# Altium schematic sheet Sheet1.SchDoc
size A4; SheetNumber: 1; SheetTotal: 2
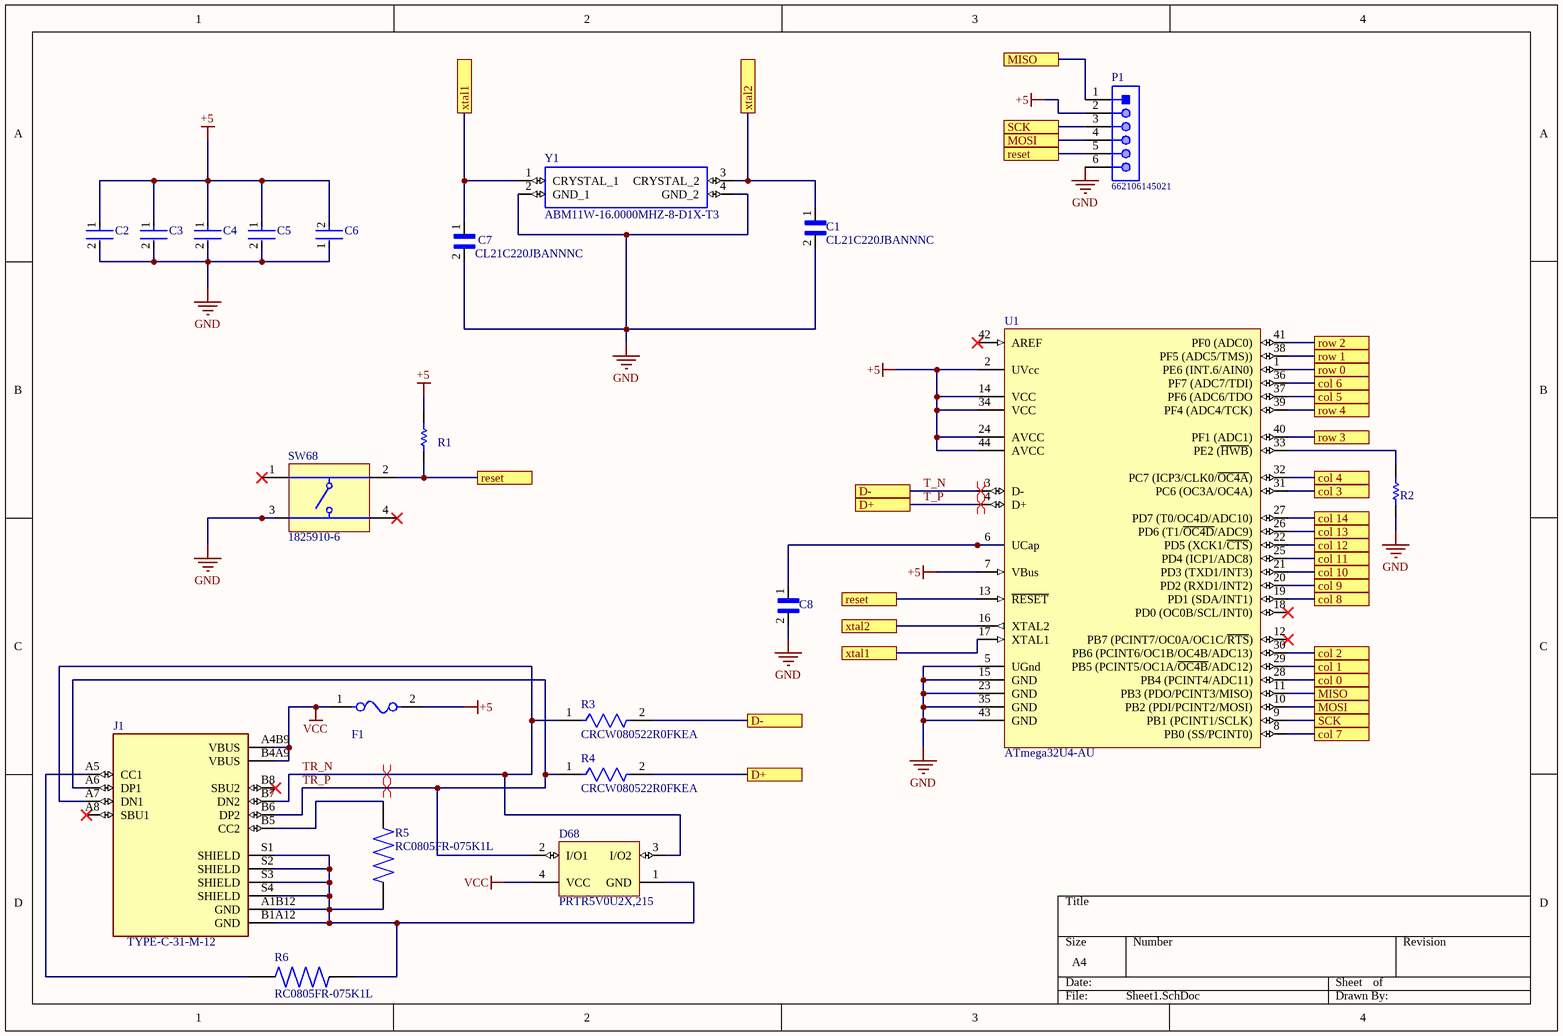
[diagram p0: Sheet1.SchDoc]

## Parts
C1  CL21C220JBANNNC  [CAPC2012X140N]
C2  (no value)  [FP-CL21-IPC_C]
C3  (no value)  [FP-CL21-IPC_C]
C4  (no value)  [FP-CL21-IPC_C]
C5  (no value)  [FP-CL21-IPC_C]
C6  (no value)  [FP-CL21B106KOQNNNE-MFG]
C7  CL21C220JBANNNC  [CAPC2012X140N]
C8  CL21B105KAFNNNE  [CAPC2012X140N]  (value not drawn)
D68  PRTR5V0U2X,215  [NXP-SOT143B-4_V]
F1  Fuse_Bel_0ZCJ0025AF2E_eec  [Bel_3216_0]  (value not drawn)
J1  TYPE-C-31-M-12  [HRO_TYPE-C-31-M-12]
P1  662106145021  [662106145021]
R1  RC0805FR-0710KL  [RESC2013X60X35NL10T20]  (value not drawn)
R2  RC0805FR-0710KL  [RESC2013X60X35NL10T20]  (value not drawn)
R3  CRCW080522R0FKEA  [FP-CRCW0805-e3-IPC_C]
R4  CRCW080522R0FKEA  [FP-CRCW0805-e3-IPC_C]
R5  RC0805FR-075K1L  [RESC2012X60N]
R6  RC0805FR-075K1L  [RESC2012X60N]
SW68  1825910-6  [TECO-1825910-6_V]
U1  ATmega32U4-AU  [44ML_M]
Y1  ABM11W-16.0000MHZ-8-D1X-T3  [ABM11W300000MHZ4B1UT3]

## Ports
col 0, col 1, col 2, col 3, col 4, col 5, col 6, col 7, col 8, col 9, col 10, col 11, col 12, col 13, col 14, D+, D-, MISO, MOSI, reset, row 0, row 1, row 2, row 3, row 4, SCK, xtal1, xtal2

## Nets
+5: C2.1 C3.1 C4.1 C5.1 C6.2 F1.2 P1.2 R1.2 U1.2(UVcc) U1.7(VBus) U1.14(VCC) U1.24(AVCC) U1.34(VCC) U1.44(AVCC)
GND: C1.2 C2.2 C3.2 C4.2 C5.2 C6.1 C7.2 C8.2 P1.6 R2.1 SW68.3 U1.5(UGnd) U1.15(GND) U1.23(GND) U1.35(GND) U1.43(GND) Y1.2(GND_1) Y1.4(GND_2)
VCC: D68.4(VCC) F1.1 J1.A4B9(VBUS) J1.B4A9(VBUS)
col 0: U1.28(PB4_(PCINT4/ADC11)) ; port col 0
col 1: U1.29(PB5_(PCINT5/OC1A/~{OC4B}/ADC12)) ; port col 1
col 2: U1.30(PB6_(PCINT6/OC1B/OC4B/ADC13)) ; port col 2
col 3: U1.31(PC6_(OC3A/OC4A)) ; port col 3
col 4: U1.32(PC7_(ICP3/CLK0/~{OC4A})) ; port col 4
col 5: U1.37(PF6_(ADC6/TDO) ; port col 5
col 6: U1.36(PF7_(ADC7/TDI)) ; port col 6
col 7: U1.8(PB0_(SS/PCINT0)) ; port col 7
col 8: U1.19(PD1_(SDA/INT1)) ; port col 8
col 9: U1.20(PD2_(RXD1/INT2)) ; port col 9
col 10: U1.21(PD3_(TXD1/INT3)) ; port col 10
col 11: U1.25(PD4_(ICP1/ADC8)) ; port col 11
col 12: U1.22(PD5_(XCK1/~{CTS})) ; port col 12
col 13: U1.26(PD6_(T1/~{OC4D}/ADC9)) ; port col 13
col 14: U1.27(PD7_(T0/OC4D/ADC10)) ; port col 14
MISO: P1.1 U1.11(PB3_(PDO/PCINT3/MISO)) ; port MISO
MOSI: P1.4 U1.10(PB2_(PDI/PCINT2/MOSI)) ; port MOSI
reset: P1.5 R1.1 SW68.2 U1.13(~{RESET}) ; port reset
row 0: U1.1(PE6_(INT.6/AIN0)) ; port row 0
row 1: U1.38(PF5_(ADC5/TMS))) ; port row 1
row 2: U1.41(PF0_(ADC0)) ; port row 2
row 3: U1.40(PF1_(ADC1)) ; port row 3
row 4: U1.39(PF4_(ADC4/TCK)) ; port row 4
SCK: P1.3 U1.9(PB1_(PCINT1/SCLK)) ; port SCK
T_N: R3.2 U1.3(D-) ; port D-
T_P: R4.2 U1.4(D+) ; port D+
TR_N: D68.3(I/O2) J1.A7(DN1) J1.B7(DN2) R3.1
TR_P: D68.2(I/O1) J1.A6(DP1) J1.B6(DP2) R4.1
xtal1: C7.1 U1.17(XTAL1) Y1.1(CRYSTAL_1) ; port xtal1
xtal2: C1.1 U1.16(XTAL2) Y1.3(CRYSTAL_2) ; port xtal2
NetC8_1: C8.1 U1.6(UCap)
NetD68_1: D68.1(GND) J1.A1B12(GND) J1.B1A12(GND) J1.S1(SHIELD) J1.S2(SHIELD) J1.S3(SHIELD) J1.S4(SHIELD) R5.1 R6.2
NetJ1_A5: J1.A5(CC1) R6.1
NetJ1_B5: J1.B5(CC2) R5.2
NetR2_2: R2.2 U1.33(PE2_(~{HWB}))

Not connected (* = marked no-connect by the designer): J1 A8(SBU1)* B8(SBU2)*; SW68 1* 4*; U1 12(PB7_(PCINT7/OC0A/OC1C/~{RTS}))* 18(PD0_(OC0B/SCL/INT0))* 42(AREF)*

## Layout directives
differential pair: T_N, T_P, TR_N, TR_P

## Library data of the parts
C1 C7 = CL21C220JBANNNC: 22pF Â±5% 50V Ceramic Capacitor C0G, NP0 0805 _2012 Metric_; MF: Samsung; Value: *; Price: None; Package: 0805 Samsung; SnapEDA_Link: https://www.snapeda.com/parts/CL21C220JBANNNC/Samsung%20Electro-Mechanics/view-part/514319/?ref=snap; Availability: Unavailable; MP: CL21C220JBANNNC
C2-C5 = CMP-2000-05017-2: CL21 Series 0805 100nF 50V ±10% Tolerance X7R Multilayer Ceramic Chip Capacitor; Depth: 1.25mm; Height: 0.85mm; Width: 0.049inch; Tolerance: 10%; Case Code (Metric): 2012; Case Code (Imperial): 0805; Material: Ceramic; Thickness: 0.037inch; Min Operating Temperature: -55°C; Contact Plating: Tin; Length: 2mm; Mount: Surface Mount; Voltage Rating (DC): 50V; Lead Free: Lead Free; Dielectric: X7R; Radiation Hardening: No; Capacitance: 100nF; Voltage Rating: 50V; Case/Package: 0805; Packaging: Tape and Reel; Max Operating Temperature: 125°C; Voltage: 50V
C6 = CMP-2000-06106-2: CAP CER 10UF 16V X7R 0805; Manufacturer Part Number: CL21B106KOQNNNE; Manufacturer: Samsung Electro-Mechanics America, Inc; Material: Ceramic; Tolerance: 10%; Temperature Coefficient: 15%; Digikey Description: CAP CER 10UF 16V X7R 0805; Lead Free: Yes; ComponentLink2URL: http://www.samsungsem.com/servlet/FileDownload?path=productsearch&sname=CL21B106KOQNNNE.pdf&oname=CL21B106KOQNNNE.pdf; ComponentLink2Description: Datasheet; Temperature Range Low: -55°C; RoHS: TRUE; Category: Cap; Temperature Characteristic: X7R; Automotive: No; Octopart: https://octopart.com/cl21b106koqnnne-samsung-19832289; Device Class L3: Ceramic Capacitors; Temperature Range High: +125°C; Height: 1.4mm; Device Class L2: Capacitors; Voltage Rating: 16V; Value: 10uF; Temperature: -55°C to +125°C; Device Class L1: Passive Components; Ipc Land Pattern Name: CAPC200125X125; Package: CL21B106KOQNNNE; Capacitance: 10uF
C8 = CL21B105KAFNNNE: 1ÂµF Â±10% 25V Ceramic Capacitor X7R 0805 (2012 Metric); MF: Samsung Electro-Mechanics; SnapEDA_Link: https://www.snapeda.com/parts/CL21B105KAFNNNE/Samsung%20Electro-Mechanics/view-part/544120/?ref=snap; Arrow_Electronics-Purchase-URL: https://snapeda.com/shop?store=Arrow+Electronics&id=544120; Arrow_Europe-Purchase-URL: https://snapeda.com/shop?store=Arrow+Europe&id=544120; MP: CL21B105KAFNNNE; Package: 0805 Samsung; DigiKey-Purchase-URL: https://snapeda.com/shop?store=DigiKey&id=544120; Digi-Key_Part_Number: 1276-1066-1-ND; Value: *; Check_prices: https://www.snapeda.com/parts/CL21B105KAFNNNE/Samsung%20Electro-Mechanics/view-part/544120/?ref=eda
D68 = CMP-2000-05285-1: Ultra Low Capacitance Double Rail-to-Rail ESD Protection Diode, 5.5 V, 1 pF, -40 to 85 degC, 4-Pin SOT143B, RoHS, Tape and Reel; Manufacturer: NXP Semiconductors; Capacitance Value: 16pF; Number of Elements: 1; Rad Hardened: No; Reverse Breakdown Voltage: 6V; Working Voltage (Max): 5.5V; Polarity: Uni-Directional; Configuration: Quad; Leakage Current: 0.1uA; Product Height (mm): 1mm; Suppressor Type: DiodeArrays; Product Length (mm): 3mm; Product Depth (mm): 1.4mm; ESD Protection Voltage: 8KV@ContactDisc; Package Type: SOT; Mounting: SurfaceMount; Packaging: TapeandReel; Datasheet Version: Rev. 02, 01/2008; Reverse Stand-off Voltage: 5.5V; Manufacturer URL: http://www.nxp.com/; Operating Temp Range: -40Cto85C; Operating Temperature Classification: Industrial; Working Voltage: 5.5V; Operating Temperature Min Deg. C: -40C; Datasheet URL: https://datasheet.ciiva.com/4479/prtr5v0u2x-102853-4479461.pdf; Leakage Current (Max): 0.1uA; Direction Type: Uni-Directional; Pin Count: 3+Tab; Operating Temperature Max Deg. C: 85C; Mounting Style: SurfaceMount; Package / Case: SOT
F1 = Fuse_Bel_0ZCJ0025AF2E_eec: FUSE PTC RESET FUSE 24V 250MA 1206; Manufacturer: Bel; Mfg Package Ident: 3216; Part Number: 0ZCJ0025AF2E; helpURL: https://upverter.com/upn/revision/1ff9a5fd39562549/; ComponentLink2Description: Datasheet; Temperature: -40°C to +85°C; Package: 3216; Supplier 2: Mouser; Price: 0.0950423728797; Supplier 1: Digi-Key; ComponentLink1URL: https://upverter.com/upn/revision/1ff9a5fd39562549/; Supplier Part Number 2: 530-0ZCJ0025AF2E; Supplier Part Number 1: 507-1799-1-ND; Voltage: 24V; ComponentLink1Description: Upverter; ComponentLink2URL: https://www.belfuse.com/resources/CircuitProtection/datasheets/0ZCJ%20Nov2016.pdf; RoHS: TRUE; Mouser Part Number: 530-0ZCJ0025AF2E; Temperature Range High: +85°C; Digikey Description: FUSE PTC RESET FUSE 24V 250MA 1206; Digikey Part Number: 507-1799-1-ND; Lead Free: yes; Temperature Range Low: -40°C
J1 = TYPE-C-31-M-12: USB Connectors 24 Receptacle 1 8.94*7.3mm RoHS; MF: HRO Electronics Co., Ltd.; Value: *; SnapEDA_Link: https://www.snapeda.com/parts/TYPE-C-31-M-12/HRO%20Electronics%20Co.,%20Ltd./view-part/3228496/?ref=snap; Package: Package; MP: TYPE-C-31-M-12; Price: None; Availability: Unavailable
P1 = CMP-1502-00486-1: SMT Male Header WR-MPC3, with SMT Solder Tabs, Right Angled, Single Row, pitch 3 mm, 6 pins; Manufacturer: Wurth Elektronik; Pin Number: 6; Working Voltage: 250VAC; Pitch: 3mm; Contact Resistance: 10mOhm; Orientation: RightAngled; Publisher: WurthElektronik; Gender: Male; Mounting Technology: SMT; Datasheet URL: https://katalog.we-online.de/em/datasheet/6621xx145021.pdf; Manufacturer URL: http://www.we-online.de; Package Reference: 662106145021; Operating Temperature: -40to105degC; Part Number: 662106145021; Packaging: TapeandReel
R1 R2 = CMP-1659-00013-4: Chip Resistor, 10 KOhm, +/- 1%, 0.125 W, -55 to 155 degC, 0805 (2012 Metric), RoHS, Tape and Reel; Manufacturer: Yageo; Voltage Rating: 150 V; Mount: Surface Mount; ComponentLink1Description: Manufacturer URL; ComponentLink2URL: http://www.yageo.com/documents/recent/PYu-RC_Group_51_RoHS_L_04.pdf; Pins: 2; Length: 2 mm; Min Operating Temperature: -55 degC; Height: 0.5 mm; Mounting Technology: Surface Mount; RoHSCompliant: true; REACH SVHC: No SVHC; ComponentLink1URL: http://www.yageo.com/; Max Operating Temperature: 155 degC; PackageReference: 0805; DatasheetVersion: Rev. 4, 02/2016; Package Quantity: 5000; Packaging: Tape and Reel; ComponentLink2Description: Datasheet; PackageDescription: 2-Pin Surface Mounted Device, Body 2 x 1.25 mm
R3 R4 = CMP-2001-03692-2: RES Thick Film, 22Ω, 1%, 0.125W, 100ppm/°C, 0805; Resistance: 22R; Power Rating: 125mW; Voltage Rating: 150V; Case/Package: 0805; Radiation Hardening: No; Number of Terminations: 2; Termination: SMD/SMT; Package Quantity: 5000; Weight: 0.000194oz; Mount: Surface Mount; Lead Free: Lead Free; Height: 0.45mm; Composition: Thick Film; Min Operating Temperature: -55°C; Case Code (Metric): 2012; Temperature Coefficient: 100ppm/°C; Depth: 1.25mm; Packaging: Tape and Reel; Contact Plating: Tin; Width: 1.25mm; Case Code (Imperial): 0805; Length: 2mm; Max Operating Temperature: 155°C; Tolerance: 1%; Features: Automotive AEC-Q200; Military Standard: Not; Voltage Rating (DC): 150V; Max Power Dissipation: 125mW
R5 R6 = RC0805FR-075K1L: Resistor: thick film; SMD; 0805; 5.1kÎ©; 0.125W; Â±1%; -55Ã·155Â°C; Package: None; Price: None; Value: *; MP: RC0805FR-075K1L; Availability: Unavailable
SW68 = CMP-1684-00021-1: Tact Switch, SPST-NO, 0.05 A, -35 to 85 degC, 4-Pin THD, RoHS, Bulk; Manufacturer: TE Connectivity; Maximum Contact Resistance: 100mOhm; Mechanical Life: 100000Cycles; Bushing Type: Unthreaded; Switch Configuration: OFF(ON); Maximum DC Voltage Rating: 24V; Contact Rating @ Voltage: 0.05A@24VDC; Actuator Color: Black; Body Orientation: Straight; Function: MomentaryContact; Illumination: N/R; Actuator Style: RoundButton; Actuator Material: PolybutyleneTerephthalate; Dielectric Strength: 500VAC; Pole Throw Configuration: SPST; Actuator Length: 1.4mm; Product Weight: N/A; Contact Material: CopperAlloy; Housing Material: N/A; Terminal Type: PCPins; Minimum Insulation Resistance: 100MOhm; Package Description: 4-Pin Through Hole Device, Body 5.99 x 5.99 mm, Pitch 6.5 mm; Part No: 1825910-6; Package Reference: THD; Base Material: N/A; Manufacturer URL: http://www.te.com; Contact Plating: Silver; RoHS: Yes; Datasheet Version: Rev. C9; Electrical Life: 100000Cycles; Maximum AC Voltage Rating: N/A; Thread Size: N/R; Operating Temperature: -35to85C; Mounting: ThroughHole; Dimension: 5.99x5mm; Datasheet URL: http://www.te.com/commerce/DocumentDelivery/DDEController?Action=showdoc&DocId=Customer+Drawing%7F1825910%7FC9%7Fpdf%7FEnglish%7FENG_CD_1825910_C9.pdf%7F1825910-6; Family: 1825910; Seal Location: N/A; Seal Description: N/A; Packaging: N/A
U1 = CMP-0095-00285-2: 8-bit AVR Microcontroller, 2.7-5.5V, 16MHz, 32KB Flash, 1KB EEPROM, 2.5KB SRAM, USB Controller, 44-pin TQFP, Industrial Grade (-40°C to 85°C), Ext Osc; RevisionNote: DatasheetVersion updated. URLs added.; ComponentLink1Description: Manufacturer URL; PackageDescription: 44-Pin Plastic Thin Quad Flat Pack, 10 x 10 x 1.0 mm Body, 0.8 mm Pitch (TQFP); DatasheetVersion: revF, Nov-2010; ComponentLink2URL: http://www.atmel.com/dyn/resources/prod_documents/doc7766.pdf; ComponentLink1URL: http://www.atmel.com/; PackageReference: 44ML; ComponentLink2Description: ATmega16U4/32U4 Datasheet; PackageVersion: rev.G, Jul-2007; ComponentLink3URL: http://www.atmel.com/dyn/resources/prod_documents/7766S.pdf; ComponentLink3Description: ATmega16U4 ATmega32U4 Summary
Y1 = ABM11W-16.0000MHZ-8-D1X-T3: 16MHz Â±10ppm Crystal 8pF 200 Ohms 4-SMD, No Lead; MF: Abracon; SnapEDA_Link: https://www.snapeda.com/parts/ABM11W-16.0000MHZ-8-D1X-T3/Abracon/view-part/2583382/?ref=snap; Mouser-Purchase-URL: https://snapeda.com/shop?store=Mouser&id=2583382; Availability: Warning; Value: *; Package: SMD-4 Abracon; MP: ABM11W-16.0000MHZ-8-D1X-T3; Price: None; BuyPart: https://www.snapeda.com/parts/ABM11W-16.0000MHZ-8-D1X-T3/Abracon/view-part/2583382/?ref=eda